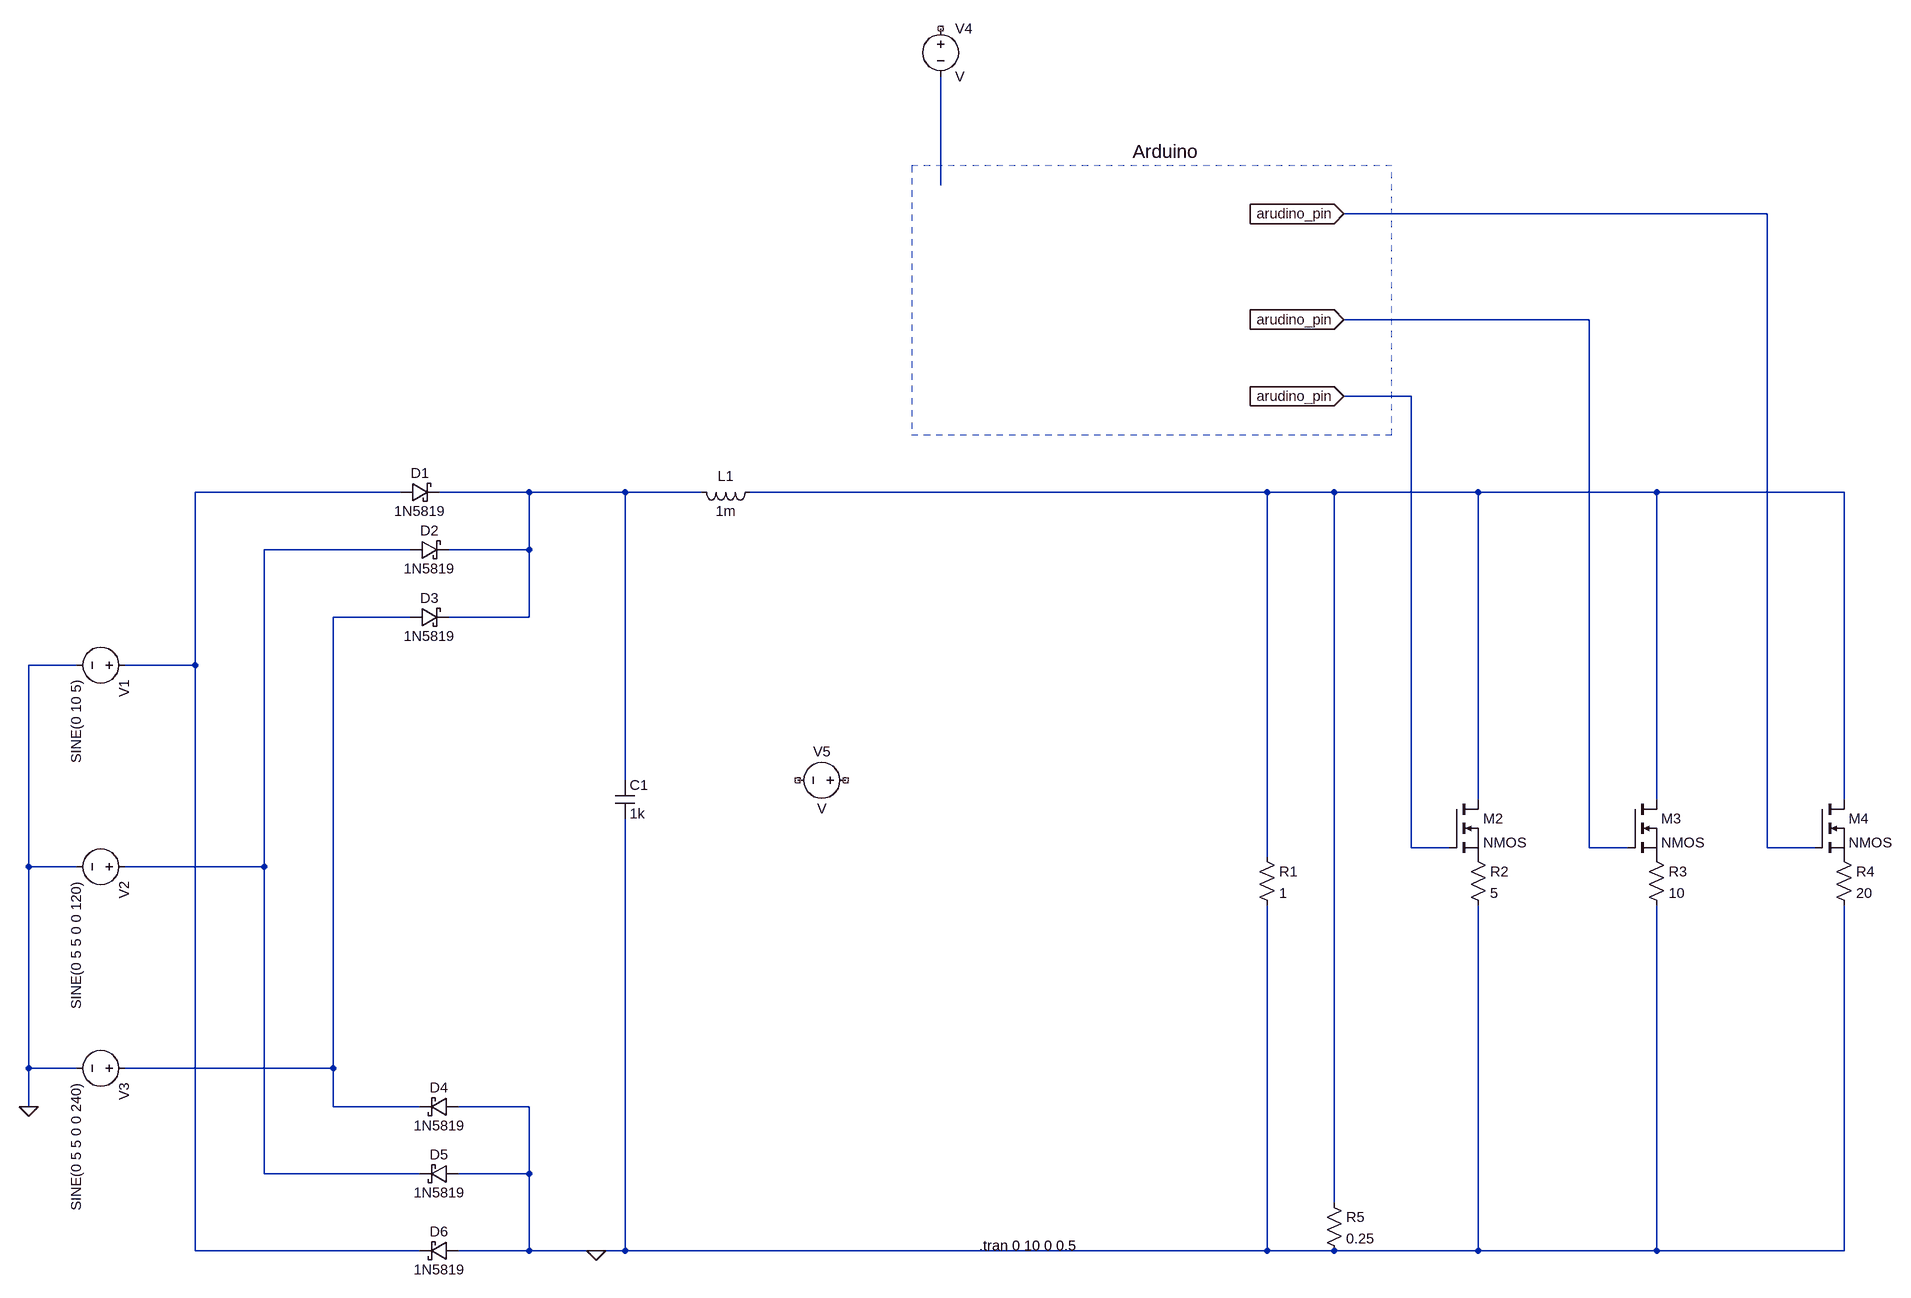
[diagram p0: schematic RectfierSpice.asc]
RectfierSpice.asc, the LTspice schematic file:
Version 4
SHEET 1 2900 880
WIRE 1232 -944 1232 -1200
WIRE 2688 -896 1904 -896
WIRE 2320 -720 1904 -720
WIRE 2016 -592 1904 -592
WIRE -928 -432 -1472 -432
WIRE -544 -432 -864 -432
WIRE -384 -432 -544 -432
WIRE -256 -432 -384 -432
WIRE 1776 -432 -176 -432
WIRE 1888 -432 1776 -432
WIRE 2128 -432 1888 -432
WIRE 2432 -432 2128 -432
WIRE 2816 -432 2432 -432
WIRE -912 -336 -1264 -336
WIRE -544 -336 -544 -432
WIRE -544 -336 -848 -336
WIRE -912 -224 -1040 -224
WIRE -544 -224 -544 -336
WIRE -544 -224 -848 -224
WIRE -1776 -144 -1856 -144
WIRE -1472 -144 -1472 -432
WIRE -1472 -144 -1696 -144
WIRE -384 48 -384 -432
WIRE 2128 80 2128 -432
WIRE 2432 80 2432 -432
WIRE 2816 80 2816 -432
WIRE 2016 160 2016 -592
WIRE 2080 160 2016 160
WIRE 2320 160 2320 -720
WIRE 2384 160 2320 160
WIRE 2688 160 2688 -896
WIRE 2768 160 2688 160
WIRE 1776 176 1776 -432
WIRE -1856 192 -1856 -144
WIRE -1776 192 -1856 192
WIRE -1264 192 -1264 -336
WIRE -1264 192 -1696 192
WIRE -1856 528 -1856 192
WIRE -1776 528 -1856 528
WIRE -1040 528 -1040 -224
WIRE -1040 528 -1696 528
WIRE -1856 592 -1856 528
WIRE -1040 592 -1040 528
WIRE -896 592 -1040 592
WIRE -544 592 -832 592
WIRE -1264 704 -1264 192
WIRE -896 704 -1264 704
WIRE -544 704 -544 592
WIRE -544 704 -832 704
WIRE 1888 752 1888 -432
WIRE -1472 832 -1472 -144
WIRE -896 832 -1472 832
WIRE -544 832 -544 704
WIRE -544 832 -832 832
WIRE -432 832 -544 832
WIRE -384 832 -384 112
WIRE -384 832 -432 832
WIRE 1776 832 1776 256
WIRE 1776 832 -384 832
WIRE 1888 832 1776 832
WIRE 2128 832 2128 256
WIRE 2128 832 1888 832
WIRE 2432 832 2432 256
WIRE 2432 832 2128 832
WIRE 2816 832 2816 256
WIRE 2816 832 2432 832
FLAG -432 832 0
FLAG -1856 592 0
FLAG 1904 -720 arudino_pin
IOPIN 1904 -720 In
FLAG 1904 -896 arudino_pin
IOPIN 1904 -896 In
FLAG 1904 -592 arudino_pin
IOPIN 1904 -592 In
DATAFLAG 1376 -432 ""
DATAFLAG 1616 -432 "I(L1)"
SYMBOL voltage -1680 -144 R90
WINDOW 123 0 0 Left 0
WINDOW 39 0 0 Left 0
SYMATTR InstName V1
SYMATTR Value SINE(0 10 5)
SYMBOL voltage -1680 192 R90
WINDOW 123 0 0 Left 0
WINDOW 39 0 0 Left 0
SYMATTR InstName V2
SYMATTR Value SINE(0 5 5 0 0 120)
SYMBOL voltage -1680 528 R90
WINDOW 123 0 0 Left 0
WINDOW 39 0 0 Left 0
SYMATTR InstName V3
SYMATTR Value SINE(0 5 5 0 0 240)
SYMBOL schottky -928 -416 R270
WINDOW 0 32 32 VTop 2
WINDOW 3 0 32 VBottom 2
SYMATTR InstName D1
SYMATTR Value 1N5819
SYMATTR Description Diode
SYMATTR Type diode
SYMBOL schottky -912 -320 R270
WINDOW 0 32 32 VTop 2
WINDOW 3 0 32 VBottom 2
SYMATTR InstName D2
SYMATTR Value 1N5819
SYMATTR Description Diode
SYMATTR Type diode
SYMBOL schottky -912 -208 R270
WINDOW 0 32 32 VTop 2
WINDOW 3 0 32 VBottom 2
SYMATTR InstName D3
SYMATTR Value 1N5819
SYMATTR Description Diode
SYMATTR Type diode
SYMBOL schottky -832 576 R90
WINDOW 0 0 32 VBottom 2
WINDOW 3 32 32 VTop 2
SYMATTR InstName D4
SYMATTR Value 1N5819
SYMATTR Description Diode
SYMATTR Type diode
SYMBOL schottky -832 688 R90
WINDOW 0 0 32 VBottom 2
WINDOW 3 32 32 VTop 2
SYMATTR InstName D5
SYMATTR Value 1N5819
SYMATTR Description Diode
SYMATTR Type diode
SYMBOL schottky -832 816 R90
WINDOW 0 0 32 VBottom 2
WINDOW 3 32 32 VTop 2
SYMATTR InstName D6
SYMATTR Value 1N5819
SYMATTR Description Diode
SYMATTR Type diode
SYMBOL cap -400 48 R0
SYMATTR InstName C1
SYMATTR Value 1k
SYMBOL ind -160 -448 R90
WINDOW 0 5 56 VBottom 2
WINDOW 3 32 56 VTop 2
SYMATTR InstName L1
SYMATTR Value 1m
SYMBOL nmos 2080 80 R0
SYMATTR InstName M2
SYMBOL nmos 2384 80 R0
SYMATTR InstName M3
SYMBOL nmos 2768 80 R0
SYMATTR InstName M4
SYMBOL res 1760 160 R0
SYMATTR InstName R1
SYMATTR Value 1
SYMBOL res 2112 160 R0
SYMATTR InstName R2
SYMATTR Value 5
SYMBOL res 2416 160 R0
SYMATTR InstName R3
SYMATTR Value 10
SYMBOL res 2800 160 R0
SYMATTR InstName R4
SYMATTR Value 20
SYMBOL res 1872 736 R0
SYMATTR InstName R5
SYMATTR Value 0.25
SYMBOL voltage 1232 -1296 R0
SYMATTR InstName V4
SYMBOL voltage 0 48 R90
WINDOW 0 -32 56 VBottom 2
WINDOW 3 32 56 VTop 2
SYMATTR InstName V5
TEXT 1296 824 Left 2 !.tran 0 10 0 0.5
TEXT 1608 -1000 Center 3 !Arduino
RECTANGLE Normal 1184 -528 1984 -976 2

The netlist it stands for:
* RectfierSpice.asc
V1 N002 0 SINE(0 10 5)
V2 N005 0 SINE(0 5 5 0 0 120)
V3 N006 0 SINE(0 5 5 0 0 240)
D1 N002 N003 1N5819
D2 N005 N003 1N5819
D3 N006 N003 1N5819
D4 0 N006 1N5819
D5 0 N005 1N5819
D6 0 N002 1N5819
C1 N003 0 1k
L1 N004 N003 1m
M2 N004 arudino_pin P001 P001 NMOS
M3 N004 arudino_pin P002 P002 NMOS
M4 N004 arudino_pin P003 P003 NMOS
R1 N004 0 1
R2 P001 0 5
R3 P002 0 10
R4 P003 0 20
R5 N004 0 0.25
V4 NC_01 N001 V
V5 NC_02 NC_03 V
.model D D
.lib standard.dio
.model NMOS NMOS
.model PMOS PMOS
.lib standard.mos
.tran 0 10 0 0.5
Arduino
.backanno
.end